# Altium project SMU_STPM_Board.PrjPcb
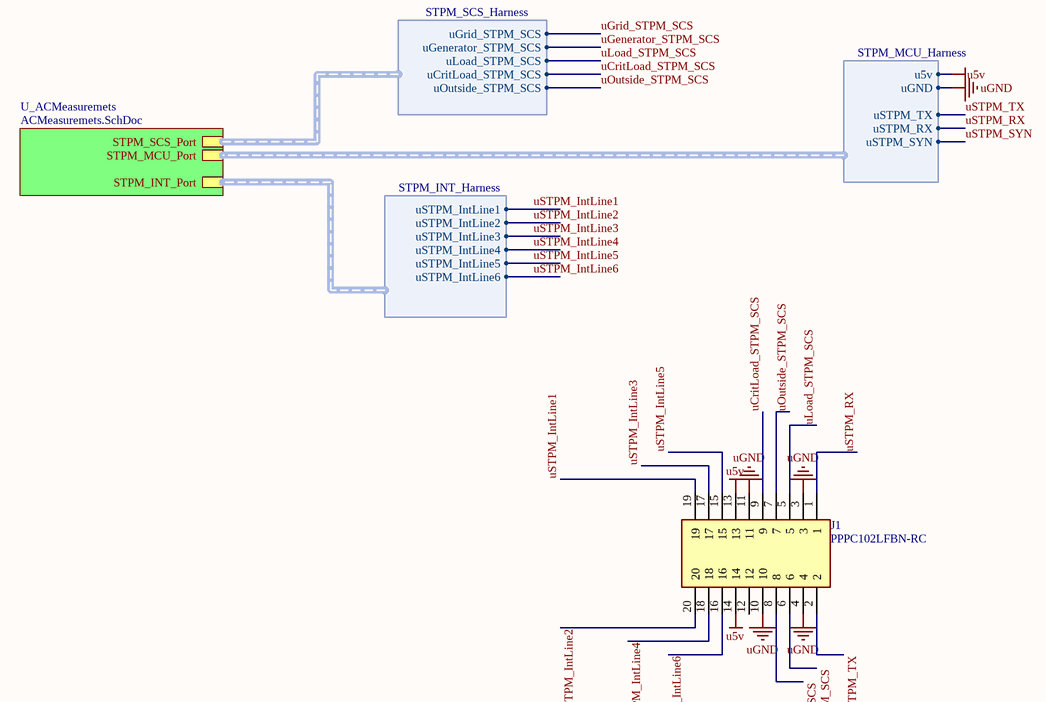
[diagram p0: SMU_STPM_Board.SchDoc]
3 sheets, 342 parts. Net scope: strictly hierarchical (ports join the sheet entries above them; power ports are local).
Board files: SMU_STPM_Board.PcbDoc, Nothing.PcbDoc
Sheets:
  SMU_STPM_Board.SchDoc
    U_ACMeasuremets = ACMeasuremets.SchDoc
      U_MeasurementUnit4 = STPM34_Meter.SchDoc
      U_MeasurementUnit3 = STPM34_Meter.SchDoc
      U_MeasurementUnit2 = STPM34_Meter.SchDoc
      U_MeasurementUnit1 = STPM34_Meter.SchDoc
      U_MeasurementUnit5 = STPM34_Meter.SchDoc

## Sheet SMU_STPM_Board.SchDoc
size A; SheetNumber: 1; SheetTotal: 3

### Parts
J1  PPPC102LFBN-RC  [RHDR20W85P254_2X10_2590X508X880P]

### Sub-sheets
U_ACMeasuremets = ACMeasuremets.SchDoc: STPM_SCS_Port (harness STPM_SCS_Harness), STPM_MCU_Port (harness STPM_MCU_Harness), STPM_INT_Port (harness STPM_INT_Harness)

### Harnesses
STPM_MCU_Harness: u5v, uGND, uSTPM_TX, uSTPM_SYN, uSTPM_RX
STPM_SCS_Harness: uGrid_STPM_SCS, uGenerator_STPM_SCS, uLoad_STPM_SCS, uCritLoad_STPM_SCS, uOutside_STPM_SCS
STPM_INT_Harness: uSTPM_IntLine1, uSTPM_IntLine2, uSTPM_IntLine3, uSTPM_IntLine4, uSTPM_IntLine5, uSTPM_IntLine6

### Nets
u5v: J1.13 J1.14 ; sheet U_ACMeasuremets/STPM_MCU_Port.u5v
uGND: J1.3 J1.4 J1.10 J1.11 ; sheet U_ACMeasuremets/STPM_MCU_Port.uGND
uCritLoad_STPM_SCS: J1.9 ; sheet U_ACMeasuremets/STPM_SCS_Port.uCritLoad_STPM_SCS
uGenerator_STPM_SCS: J1.8 ; sheet U_ACMeasuremets/STPM_SCS_Port.uGenerator_STPM_SCS
uGrid_STPM_SCS: J1.6 ; sheet U_ACMeasuremets/STPM_SCS_Port.uGrid_STPM_SCS
uLoad_STPM_SCS: J1.5 ; sheet U_ACMeasuremets/STPM_SCS_Port.uLoad_STPM_SCS
uOutside_STPM_SCS: J1.7 ; sheet U_ACMeasuremets/STPM_SCS_Port.uOutside_STPM_SCS
uSTPM_IntLine1: J1.19 ; sheet U_ACMeasuremets/STPM_INT_Port.uSTPM_IntLine1
uSTPM_IntLine2: J1.20 ; sheet U_ACMeasuremets/STPM_INT_Port.uSTPM_IntLine2
uSTPM_IntLine3: J1.17 ; sheet U_ACMeasuremets/STPM_INT_Port.uSTPM_IntLine3
uSTPM_IntLine4: J1.18 ; sheet U_ACMeasuremets/STPM_INT_Port.uSTPM_IntLine4
uSTPM_IntLine5: J1.15 ; sheet U_ACMeasuremets/STPM_INT_Port.uSTPM_IntLine5
uSTPM_IntLine6: J1.16 ; sheet U_ACMeasuremets/STPM_INT_Port.uSTPM_IntLine6
uSTPM_RX: J1.1 ; sheet U_ACMeasuremets/STPM_MCU_Port.uSTPM_RX
uSTPM_SYN: sheet U_ACMeasuremets/STPM_MCU_Port.uSTPM_SYN
uSTPM_TX: J1.2 ; sheet U_ACMeasuremets/STPM_MCU_Port.uSTPM_TX

Not connected (* = marked no-connect by the designer): J1 12

### Library data of the parts
J1 = PPPC102LFBN-RC: Connector; Manufacturer_Name: Sullins; Datasheet Link: https://www.digikey.in/en/datasheets/sullins-connector-solutions/sullins-connector-solutions78pnpxcxxxlfbnrc10492h; Height: 8.8mm; Manufacturer_Part_Number: PPPC102LFBN-RC; Digi-Key_Part_Number: S6106-ND

## Sheet ACMeasuremets.SchDoc
size A; SheetNumber: 2; SheetTotal: 3
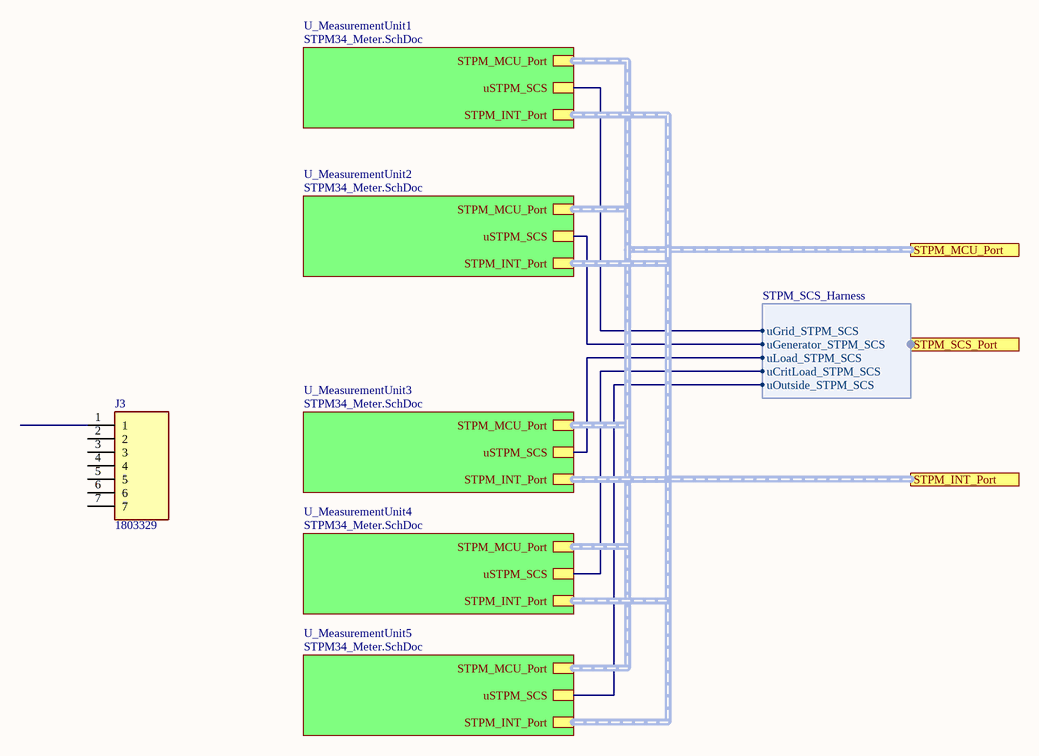
[diagram p1: ACMeasuremets.SchDoc]

### Parts
J3  1803329  [SHDRRA7W83P0X381_1X7_2806X920X825P]

### Sub-sheets
U_MeasurementUnit1 = STPM34_Meter.SchDoc: STPM_MCU_Port (harness STPM_MCU_Harness), uSTPM_SCS, STPM_INT_Port (harness STPM_INT_Harness)
U_MeasurementUnit2 = STPM34_Meter.SchDoc: STPM_MCU_Port (harness STPM_MCU_Harness), uSTPM_SCS, STPM_INT_Port (harness STPM_INT_Harness)
U_MeasurementUnit3 = STPM34_Meter.SchDoc: STPM_MCU_Port (harness STPM_MCU_Harness), uSTPM_SCS, STPM_INT_Port (harness STPM_INT_Harness)
U_MeasurementUnit4 = STPM34_Meter.SchDoc: STPM_MCU_Port (harness STPM_MCU_Harness), uSTPM_SCS, STPM_INT_Port (harness STPM_INT_Harness)
U_MeasurementUnit5 = STPM34_Meter.SchDoc: STPM_MCU_Port (harness STPM_MCU_Harness), uSTPM_SCS, STPM_INT_Port (harness STPM_INT_Harness)

### Ports
STPM_INT_Port (harness STPM_MCU_Harness), STPM_MCU_Port (harness STPM_MCU_Harness), STPM_SCS_Port (harness STPM_SCS_Harness)

### Harnesses
STPM_SCS_Harness: uGrid_STPM_SCS, uGenerator_STPM_SCS, uLoad_STPM_SCS, uCritLoad_STPM_SCS, uOutside_STPM_SCS

### Nets
uCritLoad_STPM_SCS: sheet U_MeasurementUnit4/uSTPM_SCS, port STPM_SCS_Port.uCritLoad_STPM_SCS
uGenerator_STPM_SCS: sheet U_MeasurementUnit2/uSTPM_SCS, port STPM_SCS_Port.uGenerator_STPM_SCS
uGrid_STPM_SCS: sheet U_MeasurementUnit1/uSTPM_SCS, port STPM_SCS_Port.uGrid_STPM_SCS
uLoad_STPM_SCS: sheet U_MeasurementUnit3/uSTPM_SCS, port STPM_SCS_Port.uLoad_STPM_SCS
uOutside_STPM_SCS: sheet U_MeasurementUnit5/uSTPM_SCS, port STPM_SCS_Port.uOutside_STPM_SCS

Not connected (* = marked no-connect by the designer): J3 1 2 3 4 5 6 7

### Buses and harness runs
harness port STPM_INT_Port = sheet U_MeasurementUnit1/STPM_INT_Port = sheet U_MeasurementUnit2/STPM_INT_Port = sheet U_MeasurementUnit3/STPM_INT_Port = sheet U_MeasurementUnit4/STPM_INT_Port = sheet U_MeasurementUnit5/STPM_INT_Port
harness port STPM_MCU_Port = sheet U_MeasurementUnit1/STPM_MCU_Port = sheet U_MeasurementUnit2/STPM_MCU_Port = sheet U_MeasurementUnit3/STPM_MCU_Port = sheet U_MeasurementUnit4/STPM_MCU_Port = sheet U_MeasurementUnit5/STPM_MCU_Port

### Library data of the parts
J3 = 1803329: Connector; Manufacturer_Name: Phoenix Contact; Datasheet Link: http://www.phoenixcontact.com/gb/produkte/1803329; Height: 8.25mm; Manufacturer_Part_Number: 1803329; Mouser Part Number: 651-1803329; Mouser Price/Stock: https://www.mouser.co.uk/ProductDetail/Phoenix-Contact/1803329?qs=%2FbRkJSLTVS9rpm6GtFTPVA%3D%3D; Arrow Part Number: 1803329; Arrow Price/Stock: https://www.arrow.com/en/products/1803329/phoenix-contact?region=nac; Digi-Key_Part_Number: 277-1211-ND

## Sheet STPM34_Meter.SchDoc
size B; SheetNumber: 3; SheetTotal: 3
Used 5 times, as channels U_ACMeasuremets/U_MeasurementUnit4, U_ACMeasuremets/U_MeasurementUnit3, U_ACMeasuremets/U_MeasurementUnit2, U_ACMeasuremets/U_MeasurementUnit1, U_ACMeasuremets/U_MeasurementUnit5. Parts and nets are listed once, with the designators drawn on the sheet.
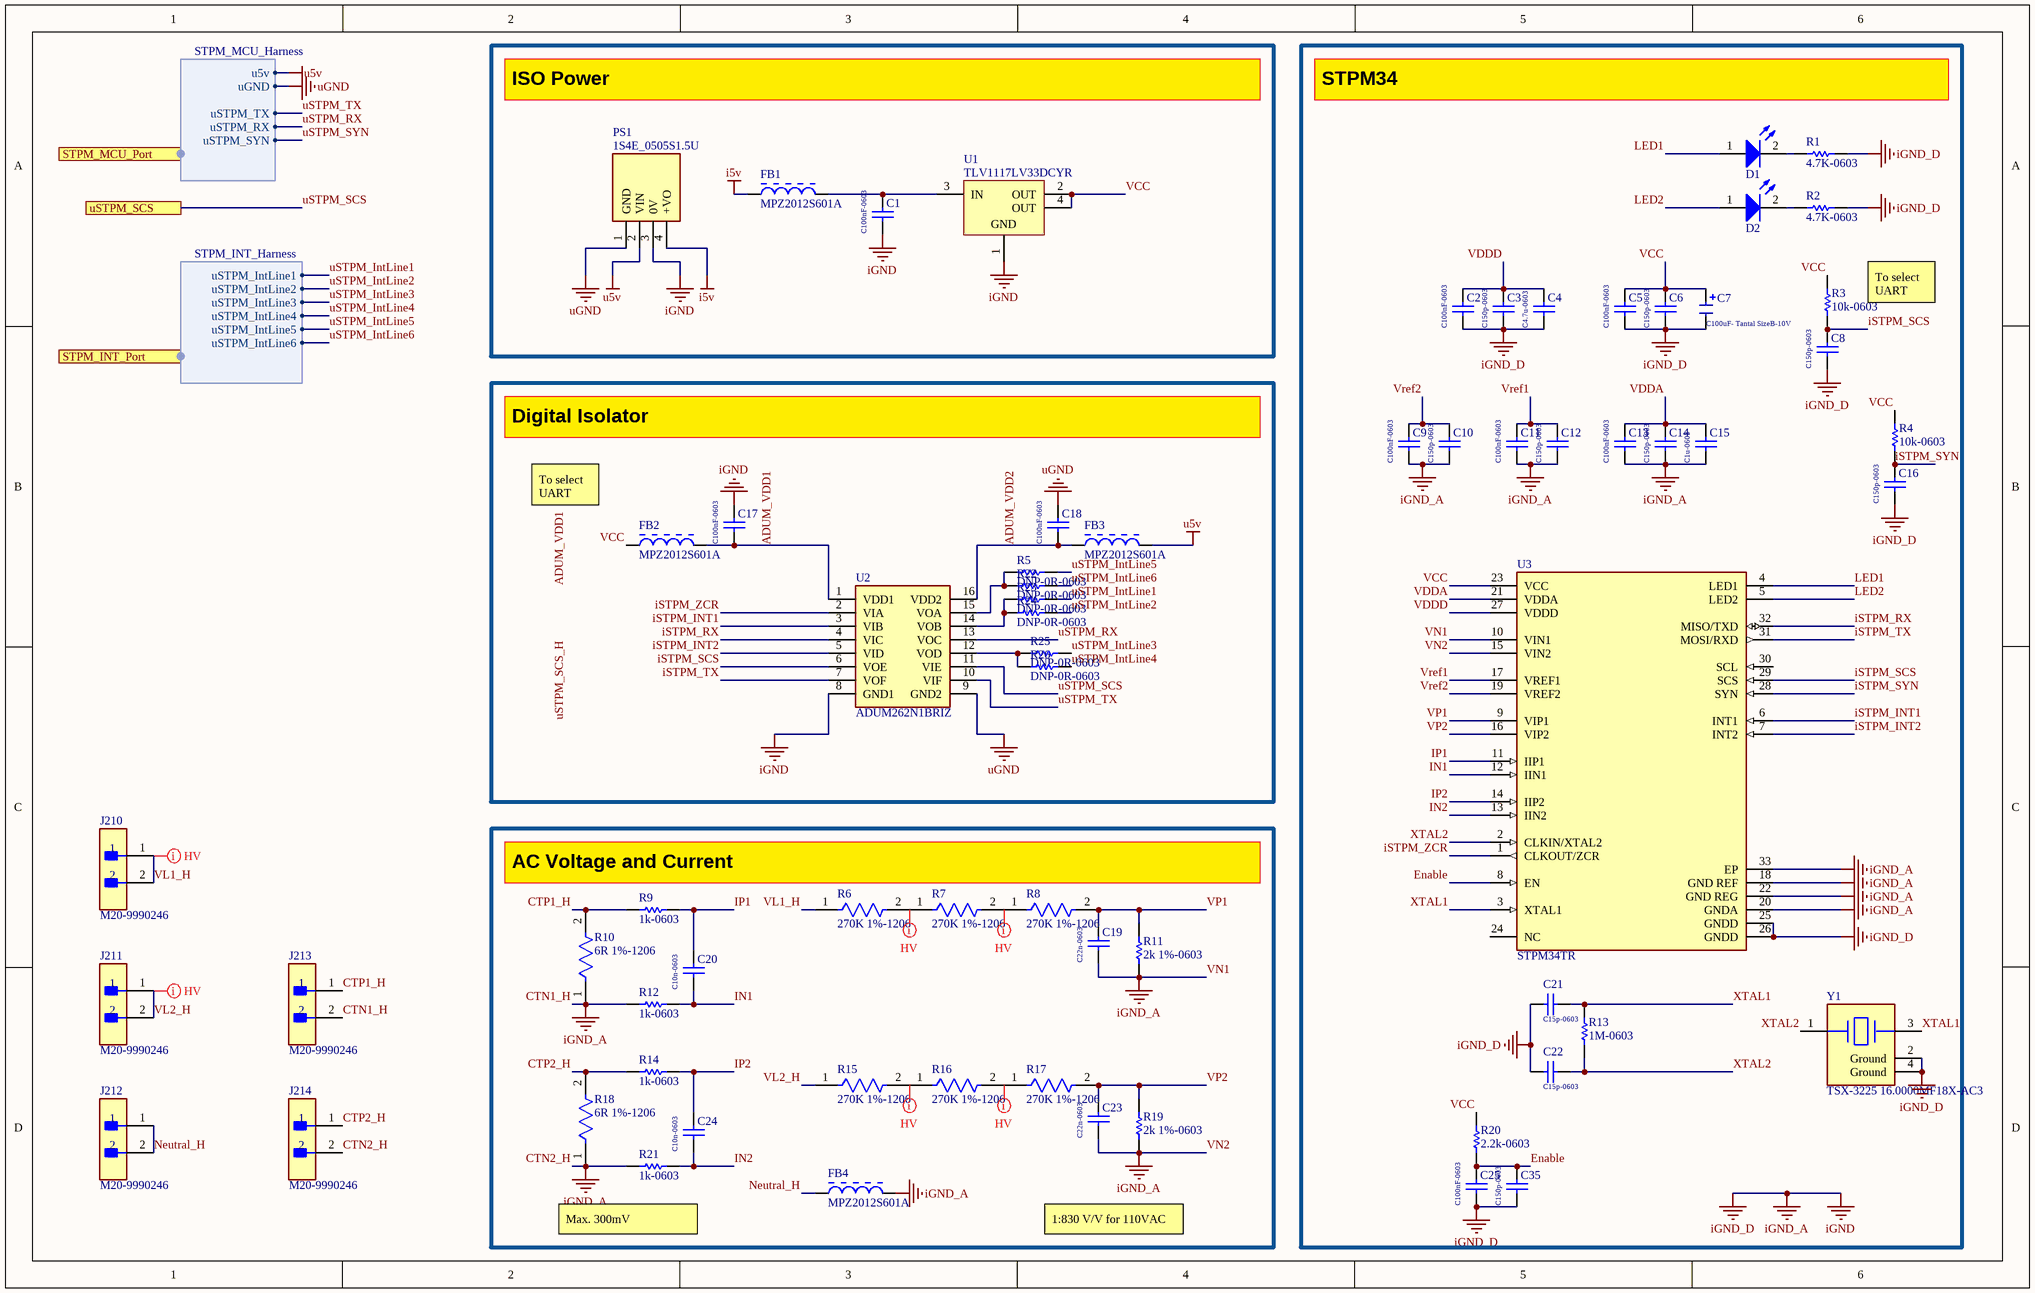
[diagram p2: STPM34_Meter.SchDoc]

### Parts
C1  C100nF-0603  [CAPC1608X90X35LL10T15]
C2  C100nF-0603  [CAPC1608X90X35LL10T15]
C3  C150p-0603  [CAPC1608X90X35LL10T15]
C4  C4.7u-0603  [CAPC1608X90X35LL10T15]
C5  C100nF-0603  [CAPC1608X90X35LL10T15]
C6  C150p-0603  [CAPC1608X90X35LL10T15]
C7  C100uF- Tantal SizeB-10V  [Tantalium Size B]
C8  C150p-0603  [CAPC1608X90X35LL10T15]
C9  C100nF-0603  [CAPC1608X90X35LL10T15]
C10  C150p-0603  [CAPC1608X90X35LL10T15]
C11  C100nF-0603  [CAPC1608X90X35LL10T15]
C12  C150p-0603  [CAPC1608X90X35LL10T15]
C13  C100nF-0603  [CAPC1608X90X35LL10T15]
C14  C150p-0603  [CAPC1608X90X35LL10T15]
C15  C1u-0603  [CAPC1608X90X35LL10T15]
C16  C150p-0603  [CAPC1608X90X35LL10T15]
C17  C100nF-0603  [CAPC1608X90X35LL10T15]
C18  C100nF-0603  [CAPC1608X90X35LL10T15]
C19  C22n-0603  [CAPC1608X90X35LL10T15]
C20  C10n-0603  [CAPC1608X90X35LL10T15]
C21  C15p-0603  [CAPC1608X90X35LL10T15]
C22  C15p-0603  [CAPC1608X90X35LL10T15]
C23  C22n-0603  [CAPC1608X90X35LL10T15]
C24  C10n-0603  [CAPC1608X90X35LL10T15]
C25  C100nF-0603  [CAPC1608X90X35LL10T15]
C35  C150p-0603  [CAPC1608X90X35LL10T15]
D1  LED_0805_green  [0805-LED]  (value not drawn)
D2  LED_0805_green  [0805-LED]  (value not drawn)
FB1  MPZ2012S601A  [TDK-MPZ2012_V]
FB2  MPZ2012S601A  [TDK-MPZ2012_V]
FB3  MPZ2012S601A  [TDK-MPZ2012_V]
FB4  MPZ2012S601A  [TDK-MPZ2012_V]
J210  M20-9990246  [FP-M20-9990246-MFG]
J211  M20-9990246  [FP-M20-9990246-MFG]
J212  M20-9990246  [FP-M20-9990246-MFG]
J213  M20-9990246  [FP-M20-9990246-MFG]
J214  M20-9990246  [FP-M20-9990246-MFG]
PS1  1S4E_0505S1.5U  [1S4E_0505S15U]
R1  4.7K-0603  [FP-MCT0603-MFG]
R2  4.7K-0603  [FP-MCT0603-MFG]
R3  10k-0603  [FP-MCT0603-MFG]
R4  10k-0603  [FP-MCT0603-MFG]
R5  DNP-0R-0603  [FP-MCT0603-MFG]
R6  270K 1%-1206  [FP-CR1206-MFG]
R7  270K 1%-1206  [FP-CR1206-MFG]
R8  270K 1%-1206  [FP-CR1206-MFG]
R9  1k-0603  [FP-MCT0603-MFG]
R10  6R 1%-1206  [FP-CR1206-MFG]
R11  2k 1%-0603  [FP-MCT0603-MFG]
R12  1k-0603  [FP-MCT0603-MFG]
R13  1M-0603  [FP-MCT0603-MFG]
R14  1k-0603  [FP-MCT0603-MFG]
R15  270K 1%-1206  [FP-CR1206-MFG]
R16  270K 1%-1206  [FP-CR1206-MFG]
R17  270K 1%-1206  [FP-CR1206-MFG]
R18  6R 1%-1206  [FP-CR1206-MFG]
R19  2k 1%-0603  [FP-MCT0603-MFG]
R20  2.2k-0603  [FP-MCT0603-MFG]
R21  1k-0603  [FP-MCT0603-MFG]
R22  DNP-0R-0603  [FP-MCT0603-MFG]
R23  DNP-0R-0603  [FP-MCT0603-MFG]
R24  DNP-0R-0603  [FP-MCT0603-MFG]
R25  DNP-0R-0603  [FP-MCT0603-MFG]
R26  DNP-0R-0603  [FP-MCT0603-MFG]
U1  TLV1117LV33DCYR  [DCY0004A_N]
U2  ADUM262N1BRIZ  [SOIC127P1031X264-16N]
U3  STPM34TR  [FP-QFN32L-7376875-MFG]
Y1  TSX-3225 16.0000MF18X-AC3  [FP-TSX-3225-MFG]

### Ports
STPM_INT_Port (harness STPM_INT_Harness), STPM_MCU_Port (harness STPM_MCU_Harness), uSTPM_SCS

### Harnesses
STPM_MCU_Harness: u5v, uGND, uSTPM_TX, uSTPM_SYN, uSTPM_RX
STPM_INT_Harness: uSTPM_IntLine1, uSTPM_IntLine2, uSTPM_IntLine3, uSTPM_IntLine4, uSTPM_IntLine5, uSTPM_IntLine6

### Nets
CTN1_H: C1.2 C2.2 C3.2 C4.2 C5.2 C6.2 C7.2 C8.2 C9.2 C10.2 C11.2 C12.2 C13.2 C14.2 C15.2 C16.2 C17.1 C19.2 C21.1 C22.1 C23.2 C25.2 C35.2 FB4.2 J213.2 J214.2 PS1.3(0V) R1.2 R2.2 R10.1 R11.1 R12.2 R18.1 R19.1 R21.2 U1.1(GND) U2.8(GND1) U3.10(VIN1) U3.15(VIN2) U3.18(GND_REF) U3.20(GNDA) U3.22(GND_REG) U3.25(GNDD) U3.26(GNDD) U3.33(EP) Y1.2(Ground) Y1.4(Ground)  [also labelled CTN2_H, iGND, iGND_A, iGND_D, VN1, VN2]
i5v: FB1.1 PS1.4(+VO)
u5v: FB3.2 PS1.2(VIN) ; port STPM_MCU_Port.u5v
uGND: C18.1 PS1.1(GND) U2.9(GND2) ; port STPM_MCU_Port.uGND
ADUM_VDD1: C17.2 FB2.2 U2.1(VDD1)
ADUM_VDD2: C18.2 FB3.1 U2.16(VDD2)
CTP1_H: J213.1 R9.2 R10.2
CTP2_H: J214.1 R14.2 R18.2
Enable: C25.1 C35.1 R20.1 U3.8(EN)
IN1: C20.2 R12.1 U3.12(IIN1)
IN2: C24.2 R21.1 U3.13(IIN2)
IP1: C20.1 R9.1 U3.11(IIP1)
IP2: C24.1 R14.1 U3.14(IIP2)
iSTPM_INT1: U2.3(VIB) U3.6(INT1)
iSTPM_INT2: U2.5(VID) U3.7(INT2)
iSTPM_RX: U2.4(VIC) U3.32(MISO/TXD)
iSTPM_SCS: C8.1 R3.1 U2.6(VOE) U3.29(SCS)
iSTPM_SYN: C16.1 R4.1 U3.28(SYN)
iSTPM_TX: U2.7(VOF) U3.31(MOSI/RXD)
iSTPM_ZCR: U2.2(VIA) U3.1(CLKOUT/ZCR)
LED1: D1.1(A) U3.4(LED1)
LED2: D2.1(A) U3.5(LED2)
Neutral_H: FB4.1 J212.1 J212.2
uSTPM_IntLine1: R23.1 ; port STPM_INT_Port.uSTPM_IntLine1
uSTPM_IntLine2: R24.1 ; port STPM_INT_Port.uSTPM_IntLine2
uSTPM_IntLine3: R25.1 ; port STPM_INT_Port.uSTPM_IntLine3
uSTPM_IntLine4: R26.1 ; port STPM_INT_Port.uSTPM_IntLine4
uSTPM_IntLine5: R5.1 ; port STPM_INT_Port.uSTPM_IntLine5
uSTPM_IntLine6: R22.1 ; port STPM_INT_Port.uSTPM_IntLine6
uSTPM_RX: U2.13(VOC) ; port STPM_MCU_Port.uSTPM_RX
uSTPM_SCS: U2.11(VIE) ; port uSTPM_SCS
uSTPM_SYN: port STPM_MCU_Port.uSTPM_SYN
uSTPM_TX: U2.10(VIF) ; port STPM_MCU_Port.uSTPM_TX
VCC: C5.1 C6.1 C7.1 FB2.1 R3.2 R4.2 R20.2 U1.2(OUT) U1.4(OUT) U3.23(VCC)
VDDA: C13.1 C14.1 C15.1 U3.21(VDDA)
VDDD: C2.1 C3.1 C4.1 U3.27(VDDD)
VL1_H: J210.1 J210.2 R6.1
VL2_H: J211.1 J211.2 R15.1
VP1: C19.1 R8.2 R11.2 U3.9(VIP1)
VP2: C23.1 R17.2 R19.2 U3.16(VIP2)
Vref1: C11.1 C12.1 U3.17(VREF1)
Vref2: C9.1 C10.1 U3.19(VREF2)
XTAL1: C21.2 R13.2 U3.3(XTAL1) Y1.3
XTAL2: C22.2 R13.1 U3.2(CLKIN/XTAL2) Y1.1
NetC1_1: C1.1 FB1.2 U1.3(IN)
NetD1_2: D1.2(K) R1.1
NetD2_2: D2.2(K) R2.1
NetR5_2: R5.2 R22.2 U2.15(VOA)
NetR6_2: R6.2 R7.1
NetR7_2: R7.2 R8.1
NetR15_2: R15.2 R16.1
NetR16_2: R16.2 R17.1
NetR23_2: R23.2 R24.2 U2.14(VOB)
NetR25_2: R25.2 R26.2 U2.12(VOD)

Not connected (* = marked no-connect by the designer): U3 24(NC) 30(SCL)

### Channels
U_ACMeasuremets/U_MeasurementUnit4: designators end in A; ports uSTPM_SCS=uCritLoad_STPM_SCS
U_ACMeasuremets/U_MeasurementUnit3: designators end in B; ports uSTPM_SCS=uLoad_STPM_SCS
U_ACMeasuremets/U_MeasurementUnit2: designators end in C; ports uSTPM_SCS=uGenerator_STPM_SCS
U_ACMeasuremets/U_MeasurementUnit1: designators end in D; ports uSTPM_SCS=uGrid_STPM_SCS
U_ACMeasuremets/U_MeasurementUnit5: designators end in E; ports uSTPM_SCS=uOutside_STPM_SCS

### Layout directives
net class HV_net: NetR6A_2, NetR7A_2, NetR15A_2, NetR16A_2, VL1_H_U_MeasurementUnit4, VL2_H_U_MeasurementUnit4

### Notes on the sheet
- ISO Power
- STPM34
- To select UART
- Digital Isolator
- AC Voltage and Current
- (near R21) Max. 300mV
- 1:830 V/V for 110VAC
- Labels drawn without touching a wire or pin: ADUM_VDD1, uSTPM_SCS_H

### Library data of the parts
C1-C6 C8-C25 C35 = Cap: Capacitor; Published: 8-Jun-2000; LatestRevisionDate: 17-Jul-2002; LatestRevisionNote: Re-released for DXP Platform.; PackageReference: RAD-0.3; Publisher: Altium Limited; PackageDescription: Radial Cap, Thru-Hole; 2 Leads; 0.3 in Pin Spacing
  C1 C2 C5 C9 C11 C13 C17 C18 C25: Value: C100nF-0603
  C3 C6 C8 C10 C12 C14 C16 C35: Value: C150p-0603
  C4: Value: C4.7u-0603
  C15: Value: C1u-0603
  C19 C23: Value: C22n-0603
  C20 C24: Value: C10n-0603
  C21 C22: Value: C15p-0603
C7 = Capacitor Tantalium
D1 D2 = LED_0805
FB1-FB4 = CMP-2000-05400-1: Chip Bead for Power Line, 600 Ohm, +/- 25%, 2 A, -55 to 125 degC, 2-Pin SMD (0805), RoHS, Tape and Reel; Manufacturer: TDK; Maximum DC Current: 2A; Impedance: 600Ohms; Test Frequency: 100MHz; Case Length: 2mm; Maximum DC Resistance: 100mOhms; Case Height: 0.85mm; Case Width: 1.25mm; Factory Pack Quantity: 4000; Operating Temperature Range: -55Cto+125C; Packaging: Reel; Datasheet URL: https://datasheet.ciiva.com/23763/1750041-23763249.pdf; Manufacturer URL: http://www.tdk.com/; Product Category: EMIFilterBeads,Chips&Arrays; Tolerance: 25%; Product: FerriteChipBeads; Package / Case: 0805(2012metric); RoHS: Details; Dimensions: 1.25mmWx2mmLx0.85mmH; Datasheet Version: Jul-13; Termination Style: SMD/SMT; Package Reference: 805; Brand: TDK; Package Description: 2-Pin Surface Mount Device, Body 2 x 1.25 mm; Digi-Key_Part_Number: 445-MPZ2012S601AT000TR-ND
J210-J214 = CMP-15831-000009-1: CONN HEADER VERT 2POS 2.54MM; Manufacturer: Harwin; Conn Gender: Male; Conn Orientation: Vertical; Number Of Contacts: 2; Current Rating: 3A; ComponentLink2URL: https://cdn.harwin.com/pdfs/M20-999.pdf; ComponentLink2Description: Datasheet; Package: M20-9990246; Temperature: -40°C to +105°C; Octopart: https://octopart.com/m20-9990246-harwin-2590635; Mouser Description: 2.54mm (0.1") Pitch SIL Vertical PC Tail Pin Header, 6.1mm mating pin height, tin, 2 contacts; Temperature Range High: +105°C; Device Class L1: Connectors; RoHS: TRUE; Automotive: No; Height: 8.99mm; Number Of Rows: 1; Contact Material: Tin,Nickel; Category: Conn; Pitch: 2.54mm; Lead Free: Yes; Digikey Description: CONN HEADER VERT 2POS 2.54MM; Manufacturer Part Number: M20-9990246; Temperature Range Low: -40°C; Device Class L3: unset; Device Class L2: Headers and Wire Housings; Digi-Key_Part_Number: 609-6349-ND
PS1 = 1S4E_0505S1.5U: Power Supply; Manufacturer_Name: Gaptec; Datasheet Link: https://gaptec-electronic.com/datenblaetter/1S4E_1.5U.pdf; Height: 10.25mm; Manufacturer_Part_Number: 1S4E_0505S1.5U; Digi-Key_Part_Number: 3182-1S4E_0505S1.5U-ND
R1 R2 = ERQF06: smd; Note: If flow soldering, adjust pad width of PCB Footprint to 0.7 - 0.8 times the width of the resistor.; Published: 17-Dec-2003; LatestRevisionDate: 19-Mar-2004; LatestRevisionNote: Silkscreen size reduced.; PackageDocument: Mar-2003; PackageReference: 6-0805; Publisher: Altium Limited; Code_IPC: 2012 [0805]; ComponentLink1Description: Manufacturer Link; ComponentLink1URL: http://www.panasonic.com/industrial/components/resistive_products.htm; ComponentLink2Description: Datasheet; ComponentLink2URL: http://www.panasonic.com/industrial/components/pdf/AOB0000CE1.pdf; value: 4.7K-0603
R3-R5 R9 R12-R14 R20-R26 = Res1: Resistor; Value: 1K; Published: 8-Jun-2000; LatestRevisionDate: 17-Jul-2002; LatestRevisionNote: Re-released for DXP Platform.; PackageReference: AXIAL-0.3; Publisher: Altium Limited; PackageDescription: Axial Device, Thru-Hole; 2 Leads; 0.3 in Pin Spacing
R6-R8 R10 R15-R18 = CMP-2000-06118-2: Thick Film Chip Resistors 1206 0Ω 0.25W 5%; Power Rating: 250mW; Voltage Rating: 200V; Resistance: 0mR; Temperature Coefficient: 500ppm/°C; Military Standard: Not; Max Power Dissipation: 250mW; Case Code (Imperial): 1206; Width: 1.6mm; Case Code (Metric): 3216; Radiation Hardening: No; Termination: SMD/SMT; Height: 0.6mm; Min Operating Temperature: -55°C; Number of Pins: 2; Voltage Rating (DC): 200V; Mount: Surface Mount; Depth: 1.6mm; Length: 3.2mm; Package Quantity: 5000; Tolerance: 5%; Packaging: Tape and Reel; Max Operating Temperature: 155°C; Contact Plating: Tin; Thickness: 610um; Composition: Thick Film; REACH SVHC: No SVHC; Case/Package: 1206
  R6-R8 R15-R17: Digi-Key_Part_Number: 541-270KFTR-ND
  R10 R18: Digi-Key_Part_Number: 541-5.90FFTR-ND
R11 R19 = Res1: Resistor; Published: 8-Jun-2000; LatestRevisionDate: 17-Jul-2002; LatestRevisionNote: Re-released for DXP Platform.; PackageReference: AXIAL-0.3; Publisher: Altium Limited; PackageDescription: Axial Device, Thru-Hole; 2 Leads; 0.3 in Pin Spacing; Value: 2K; Digi-Key_Part_Number: 541-3953-2-ND
U1 = CMP-0395-00503-2: Single Output LDO, 1 A, Fixed 3.3 V Output, 2 to 5.5 V Input, 4-pin SOT-223 (DCY), -40 to 125 degC, Green (RoHS & no Sb/Br); Manufacturer: Texas Instruments; Vout Adj(Min)(V): 3.3; Vdo(Typ)(mV): 1200; Iq(Typ)(mA): 0.05; Accuracy(%): 2; Iout(Max)(A): 1; SubFamily: Single Channel LDO; Vin(Max)(V): 5.5; PackageReference: DCY0004A; PackageDescription: 4-Pin Plastic Small Outline, Body 3.5 x 6.5 mm, Pitch 2.3 mm; Vout Adj(Max)(V): 3.3; Mounting Technology: Surface Mount; ComponentLink2Description: Datasheet; ComponentLink1Description: Manufacturer URL; PartNumber: TLV1117LV33DCYR; ComponentLink3Description: Package Specification; ComponentLink1URL: http://www.ti.com/; ComponentLink2URL: http://www.ti.com/general/docs/lit/getliterature.tsp?genericPartNumber=TLV1117LV33&fileType=pdf; Fixed Output Options(V): 3.3; PackageVersion: 4202506/B; Vin(Min)(V): 2; DatasheetVersion: SBVS160A; Eco-Plan: Green (RoHS & no Sb/Br); ComponentLink3URL: http://www.ti.com/litv/pdf/mpds094a; Code_JEDEC: TO-261; Digi-Key_Part_Number: 296-28778-2-ND
U2 = ADUM262N1BRIZ: Integrated Circuit; Manufacturer_Name: Analog Devices; Datasheet Link: http://www.analog.com/media/en/technical-documentation/data-sheets/ADuM260N-261N-262N-263N.pdf; Height: 2.64mm; Manufacturer_Part_Number: ADUM262N1BRIZ; Mouser Part Number: 584-ADUM262N1BRIZ; Mouser Price/Stock: https://www.mouser.co.uk/ProductDetail/Analog-Devices/ADUM262N1BRIZ?qs=OpCP5WdiozccuiyVbRk9Sg%3D%3D; Arrow Part Number: ADUM262N1BRIZ; Arrow Price/Stock: https://www.arrow.com/en/products/adum262n1briz/analog-devices?region=nac; Digi-Key_Part_Number: 505-ADUM262N1WBRIZ-ND
U3 = CMP-12146-000007-1: IC ENERGY METER 1PHASE 32QFN; Accuracy: 0.1%; Max Supply Voltage: 3.65V; Operating Supply Voltage: 3.3V; Min Supply Voltage: 2.95V; Number of Channels: 2; Operating Supply Current: 5.5mA; Interface: SPI; Packaging: Tape and Reel; Min Operating Temperature: -40°C; Package Quantity: 3000; Lead Free: Lead Free; REACH SVHC: No SVHC; Max Operating Temperature: 85°C; RoHS Compliant: Yes; Number of Pins: 32; Case/Package: VQFN; Mount: Surface Mount; Digi-Key_Part_Number: 497-14670-2-ND
Y1 = CMP-2000-07332-2: CRYSTAL 16.0000MHZ 9PF SMD; Frequency: 16MHz; Drive Level: 200uW; Frequency Stability: 18ppm; Frequency Tolerance: 10ppm; ESR (Equivalent Series Resistance): 60R; RoHS Compliant: Yes; Weight: 0.000564oz; Series: TSX-3225; Packaging: Tape and Reel; Mount: Surface Mount; Min Operating Temperature: -40°C; Case/Package: SMD/SMT; Width: 0.098inch; Length: 0.126inch; Load Capacitance: 9pF; Lead Free: Lead Free; Termination: SMD/SMT; Max Operating Temperature: 85°C; Package Quantity: 250; Tolerance: 10ppm; Height: 0.024inch; Digi-Key_Part_Number: SER3636TR-ND

## Nets that join several sheets
u5v: SMU_STPM_Board (J1.13 J1.14), U_ACMeasuremets/U_MeasurementUnit4 (FB3A.2 PS1A.2), U_ACMeasuremets/U_MeasurementUnit3 (FB3B.2 PS1B.2), U_ACMeasuremets/U_MeasurementUnit2 (FB3C.2 PS1C.2), U_ACMeasuremets/U_MeasurementUnit1 (FB3D.2 PS1D.2), U_ACMeasuremets/U_MeasurementUnit5 (FB3E.2 PS1E.2)
uGND: SMU_STPM_Board (J1.3 J1.4 J1.10 J1.11), U_ACMeasuremets/U_MeasurementUnit4 (C18A.1 PS1A.1 U2A.9), U_ACMeasuremets/U_MeasurementUnit3 (C18B.1 PS1B.1 U2B.9), U_ACMeasuremets/U_MeasurementUnit2 (C18C.1 PS1C.1 U2C.9), U_ACMeasuremets/U_MeasurementUnit1 (C18D.1 PS1D.1 U2D.9), U_ACMeasuremets/U_MeasurementUnit5 (C18E.1 PS1E.1 U2E.9)
uCritLoad_STPM_SCS: SMU_STPM_Board (J1.9), U_ACMeasuremets/U_MeasurementUnit4 (U2A.11)
uGenerator_STPM_SCS: SMU_STPM_Board (J1.8), U_ACMeasuremets/U_MeasurementUnit2 (U2C.11)
uGrid_STPM_SCS: SMU_STPM_Board (J1.6), U_ACMeasuremets/U_MeasurementUnit1 (U2D.11)
uLoad_STPM_SCS: SMU_STPM_Board (J1.5), U_ACMeasuremets/U_MeasurementUnit3 (U2B.11)
uOutside_STPM_SCS: SMU_STPM_Board (J1.7), U_ACMeasuremets/U_MeasurementUnit5 (U2E.11)
uSTPM_IntLine1: SMU_STPM_Board (J1.19), U_ACMeasuremets/U_MeasurementUnit4 (R23A.1), U_ACMeasuremets/U_MeasurementUnit3 (R23B.1), U_ACMeasuremets/U_MeasurementUnit2 (R23C.1), U_ACMeasuremets/U_MeasurementUnit1 (R23D.1), U_ACMeasuremets/U_MeasurementUnit5 (R23E.1)
uSTPM_IntLine2: SMU_STPM_Board (J1.20), U_ACMeasuremets/U_MeasurementUnit4 (R24A.1), U_ACMeasuremets/U_MeasurementUnit3 (R24B.1), U_ACMeasuremets/U_MeasurementUnit2 (R24C.1), U_ACMeasuremets/U_MeasurementUnit1 (R24D.1), U_ACMeasuremets/U_MeasurementUnit5 (R24E.1)
uSTPM_IntLine3: SMU_STPM_Board (J1.17), U_ACMeasuremets/U_MeasurementUnit4 (R25A.1), U_ACMeasuremets/U_MeasurementUnit3 (R25B.1), U_ACMeasuremets/U_MeasurementUnit2 (R25C.1), U_ACMeasuremets/U_MeasurementUnit1 (R25D.1), U_ACMeasuremets/U_MeasurementUnit5 (R25E.1)
uSTPM_IntLine4: SMU_STPM_Board (J1.18), U_ACMeasuremets/U_MeasurementUnit4 (R26A.1), U_ACMeasuremets/U_MeasurementUnit3 (R26B.1), U_ACMeasuremets/U_MeasurementUnit2 (R26C.1), U_ACMeasuremets/U_MeasurementUnit1 (R26D.1), U_ACMeasuremets/U_MeasurementUnit5 (R26E.1)
uSTPM_IntLine5: SMU_STPM_Board (J1.15), U_ACMeasuremets/U_MeasurementUnit4 (R5A.1), U_ACMeasuremets/U_MeasurementUnit3 (R5B.1), U_ACMeasuremets/U_MeasurementUnit2 (R5C.1), U_ACMeasuremets/U_MeasurementUnit1 (R5D.1), U_ACMeasuremets/U_MeasurementUnit5 (R5E.1)
uSTPM_IntLine6: SMU_STPM_Board (J1.16), U_ACMeasuremets/U_MeasurementUnit4 (R22A.1), U_ACMeasuremets/U_MeasurementUnit3 (R22B.1), U_ACMeasuremets/U_MeasurementUnit2 (R22C.1), U_ACMeasuremets/U_MeasurementUnit1 (R22D.1), U_ACMeasuremets/U_MeasurementUnit5 (R22E.1)
uSTPM_RX: SMU_STPM_Board (J1.1), U_ACMeasuremets/U_MeasurementUnit4 (U2A.13), U_ACMeasuremets/U_MeasurementUnit3 (U2B.13), U_ACMeasuremets/U_MeasurementUnit2 (U2C.13), U_ACMeasuremets/U_MeasurementUnit1 (U2D.13), U_ACMeasuremets/U_MeasurementUnit5 (U2E.13)
uSTPM_TX: SMU_STPM_Board (J1.2), U_ACMeasuremets/U_MeasurementUnit4 (U2A.10), U_ACMeasuremets/U_MeasurementUnit3 (U2B.10), U_ACMeasuremets/U_MeasurementUnit2 (U2C.10), U_ACMeasuremets/U_MeasurementUnit1 (U2D.10), U_ACMeasuremets/U_MeasurementUnit5 (U2E.10)